# EAGLE design Callisto_Minor_2_Relays_v1p0 (EAGLE 9.6.2)
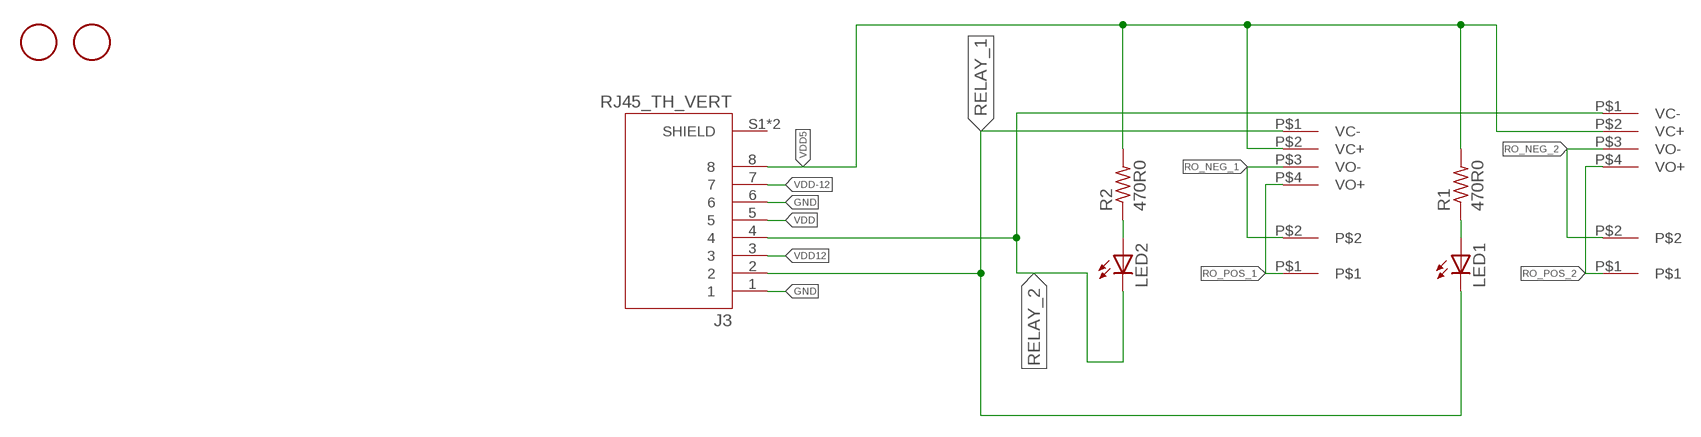
[diagram p0: schematic, sheet 1]

## Parts
J1  2-pos  3.81MM_1_X_2_RT_ANGLE_PLUG_HEADER  [2_3.81MM_PITCH]
J2  2-pos  3.81MM_1_X_2_RT_ANGLE_PLUG_HEADER  [2_3.81MM_PITCH]
J3  RJ45_TH_VERT  [ASSMANN_A-2014-2S-4-N-R]
LED1  Green  LED_0805_GREEN  [0805]
LED2  Green  LED_0805_GREEN  [0805]
R1  470R0  R_0402_470R0  [0402]
R2  470R0  R_0402_470R0  [0402]
U$1  FIDUCIAL_1MM  [FIDUCIAL_1MM]
U$2  FIDUCIAL_1MM  [FIDUCIAL_1MM]
U$3  RELAY_KYOTO_KF0604D  [RELAY_KYOTO_KF0604D]
U$5  RELAY_KYOTO_KF0604D  [RELAY_KYOTO_KF0604D]

## Nets
GND: J3.1 J3.6
N$1: LED1.1(A) R1.P$1
N$7: LED2.1(A) R2.P$1
RELAY_1: J3.2 LED1.2(C) U$3.P$1(VC-)
RELAY_2: J3.4 LED2.2(C) U$5.P$1(VC-)
RO_NEG_1: J1.P$2 U$3.P$3(VO-)
RO_NEG_2: J2.P$2 U$5.P$3(VO-)
RO_POS_1: J1.P$1 U$3.P$4(VO+)
RO_POS_2: J2.P$1 U$5.P$4(VO+)
VDD: J3.5
VDD5: J3.8 R1.P$2 R2.P$2 U$3.P$2(VC+) U$5.P$2(VC+)
VDD12: J3.3
VDD-12: J3.7
Unconnected: J3.S1(SHIELD) J3.S2(SHIELD)

## Library data of the parts
J1 J2 = 3D_MIG_Controller:3.81MM_1_X_2_RT_ANGLE_PLUG_HEADER: TERM BLOCK HDR 2POS 90DEG 3.81MM; PARTNO: 691322310002
J3 = 3D_MIG_Controller:RJ45_TH_VERT: Jack Modular Connector 8p8c (RJ45, Ethernet) Vertical Shielded; DESCRIPTION: Jack Modular Connector 8p8c (RJ45, Ethernet) Vertical Shielded; DIGI-KEY_PART_NUMBER: AE10399-ND; MF: Assmann WSW Components; MP: A-2014-2S-4-N-R; PACKAGE: None
LED1 LED2 = 3D_MIG_Controller:LED_0805_GREEN: Green 570nm LED Indication - Discrete 2.2V 0805 (2012 Metric); PARTNO: LG R971-KN-1
R1 R2 = 3D_MIG_Controller:R_0402_470R0; PARTNO: RMCF0402JT470R
U$1 U$2 = 3D_MIG_Controller:FIDUCIAL_1MM: For use by pick and place machines to calibrate the vision/machine, 1mm By microbuilder.eu
U$3 U$5 = 3D_MIG_Controller:RELAY_KYOTO_KF0604D

## Board
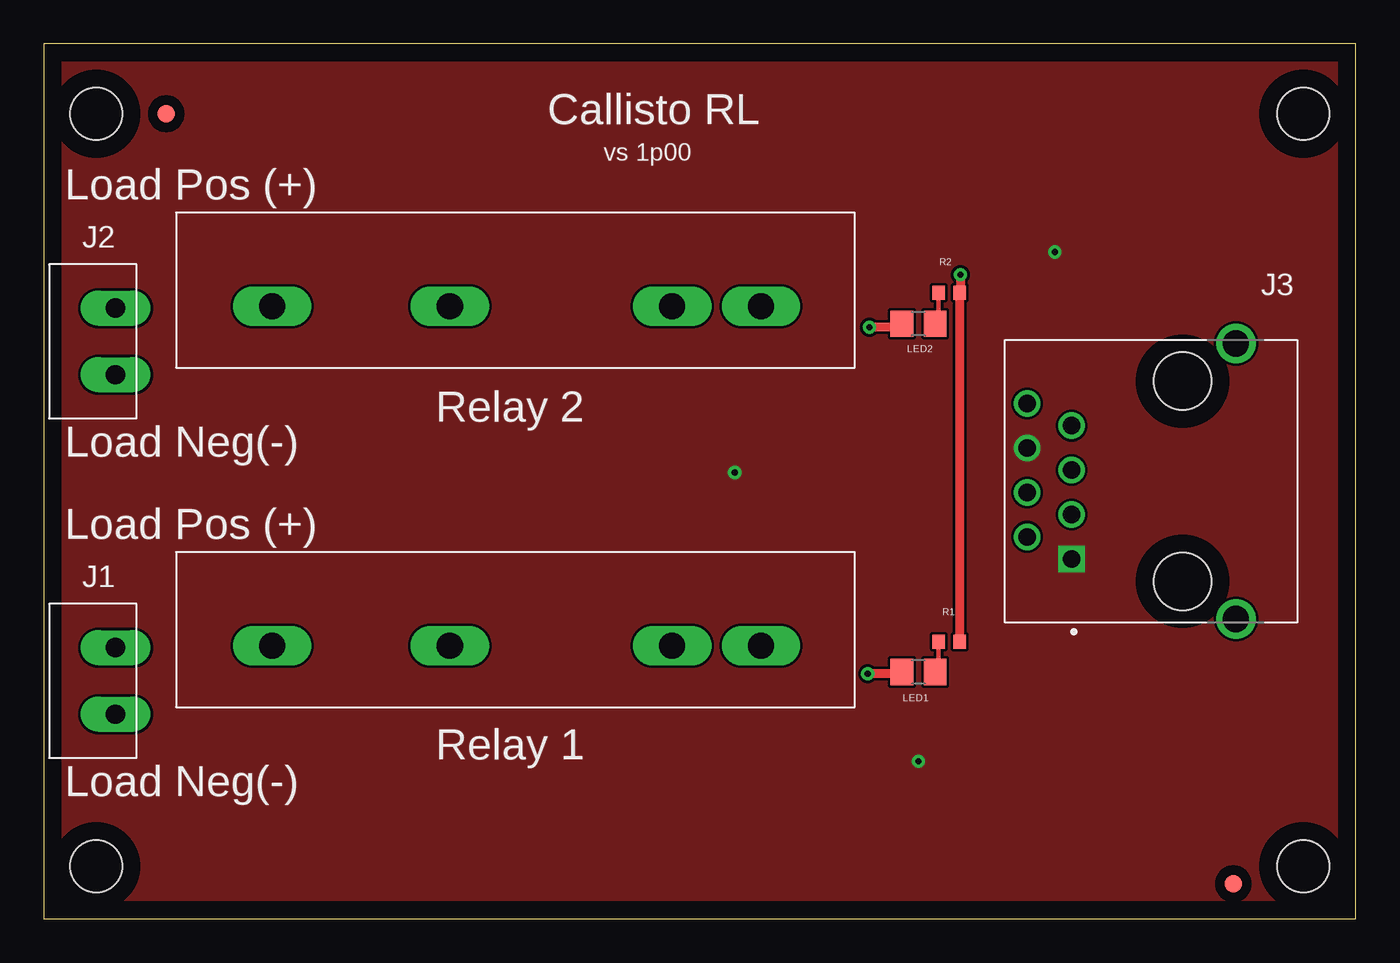
[diagram p1: board, top side]
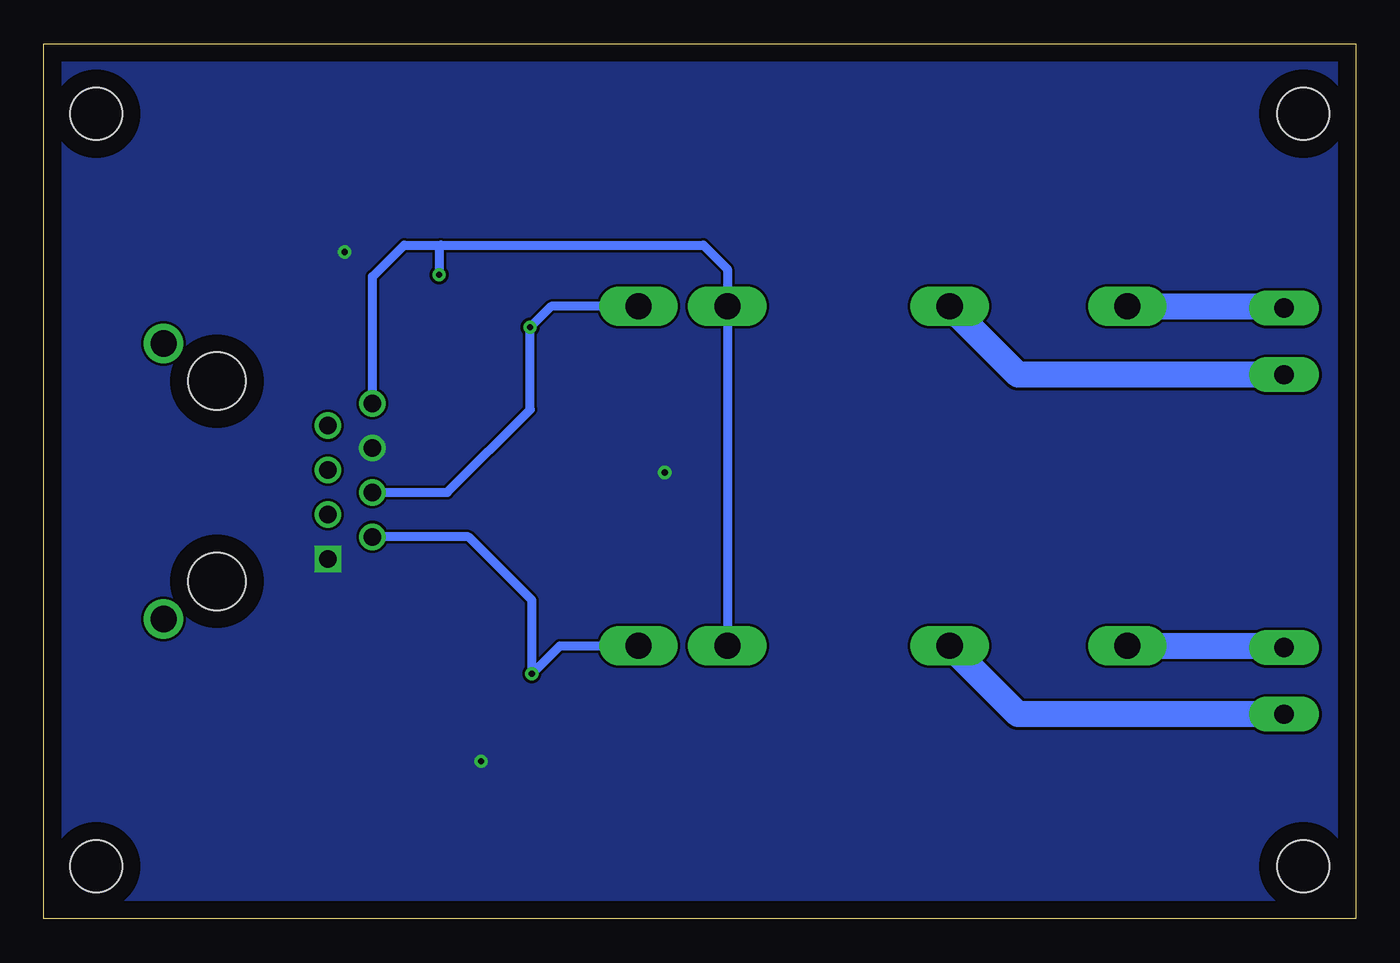
[diagram p2: board, bottom side, seen from below]

Size 75 x 50 mm. Coordinates in mm from the lower left corner, seen from the top.
Outline: 0,0 75,0 75,50 0,50 0,0
Copper layers (1*16): Top 0.035mm / dielectric 1.5mm / Bottom 0.035mm
Design rules "default": minimum track width 6mil, minimum drill 0.35mm, track to track 6mil, track to pad 6mil, pad to pad 6mil, via to via 6mil, smd to smd 6mil, copper to edge 40mil, drill to drill 6mil, minimum pad ring 10mil, minimum via ring 8mil, stop-mask expansion 4mil, vias tented up to drill 0mil, thermal gap 10mil
Holes 3 mm at 72,46 3,46 72,3 3,3

### Footprints (pad centres in the part's own frame; a part is rotated, then mirrored left to right if it is on the bottom)
2_3.81MM_PITCH = drill 1.1 pad 2 long: P$1 0,0; P$2 3.81,0
ASSMANN_A-2014-2S-4-N-R = drill 1 square: 1 4.445,-6.35 | drill 1: 2 3.175,-8.89; 3 1.905,-6.35; 4 0.635,-8.89; 5 -0.635,-6.35; 6 -1.905,-8.89; 7 -3.175,-6.35; 8 -4.445,-8.89 | drill 1.5: S1 -7.875,3.05; S2 7.875,3.05 | hole 3.3: -5.715,0; 5.715,0
0805 = smd 1.3 x 1.5: 1 -0.95,0; 2 0.95,0
0402 = smd 0.8 x 0.7: P$1 0,0.6; P$2 0,-0.6
FIDUCIAL_1MM = smd 1 x 1: 1 0,0
RELAY_KYOTO_KF0604D = drill 1.5 long: P$1 0,0; P$2 -5.08,0; P$3 -17.78,0; P$4 -27.94,0

### Placement (x,y rotation side)
J1  4.1,15.5 270 top
J2  4.1,34.9 270 top
J3  65.1,25 270 top
LED1  50,14.1 180 top
LED2  50,34 180 top
R1  51.75,15.83 90 top
R2  51.75,35.76 90 top
U$1  7,46 0 top
U$2  68,2 0 top
U$3  41,15.6 0 top
U$5  41,35 0 top

### Tracks (layer width: path | path; a pad name or v marks a point on that pad's centre or on a via)
GND  (via drill 0.35)
  other vias: 39.5,25.5 50,9 57.8,38.1
  pour Top (no thermals): 0,50.1 75,50.1 75,0 0,0
  pour Bottom (no thermals): 0,50.1 75,50.1 75,0 0,0
N$1
  Top 0.254: R1.P$1 51.15,14.3 LED1.1
N$7
  Top 0.254: R2.P$1 51.15,34.2 LED2.1
RELAY_1  (via drill 0.35)
  Top 0.508: LED1.2 48.95,14 v47.1,14
  Bottom 0.508: U$3.P$1 45.5,15.6 v47.1,14 47.1,18.2 50.73,21.82 J3.2
RELAY_2  (via drill 0.35)
  Top 0.508: LED2.2 48.85,33.8 v47.2,33.8
  Bottom 0.508: U$5.P$1 46,35 v47.2,33.8 47.2,29.1 51.94,24.36 J3.4
RO_NEG_1
  Bottom 1.5: J1.P$2 19.31,11.69 U$3.P$3
RO_NEG_2
  Bottom 1.5: J2.P$2 19.31,31.09 U$5.P$3
RO_POS_1
  Bottom 1.5: U$3.P$4 4.2,15.6 J1.P$1
RO_POS_2
  Bottom 1.5: U$5.P$4 4.2,35 J2.P$1
VDD5  (via drill 0.35)
  Top 0.508: v52.4,36.8 52.4,35.81 R2.P$2 R1.P$2
  Bottom 0.508: J3.8 56.21,36.69 54.4,38.5 52.3,38.5 | 52.3,38.5 37.3,38.5 35.92,37.12 U$5.P$2 U$3.P$2 | 52.3,38.5 52.4,38.4 v52.4,36.8

### Text on the board
tPlace: Callisto RL | vs 1p00 | Load Pos (+) | Relay 2 | Load Neg(-) | Load Pos (+) | Relay 1 | Load Neg(-)